# Altium schematic sheet 2020-08-15_10-10-351.schdoc
size 265 x 111 mm; SheetNumber: 1; SheetTotal: 1
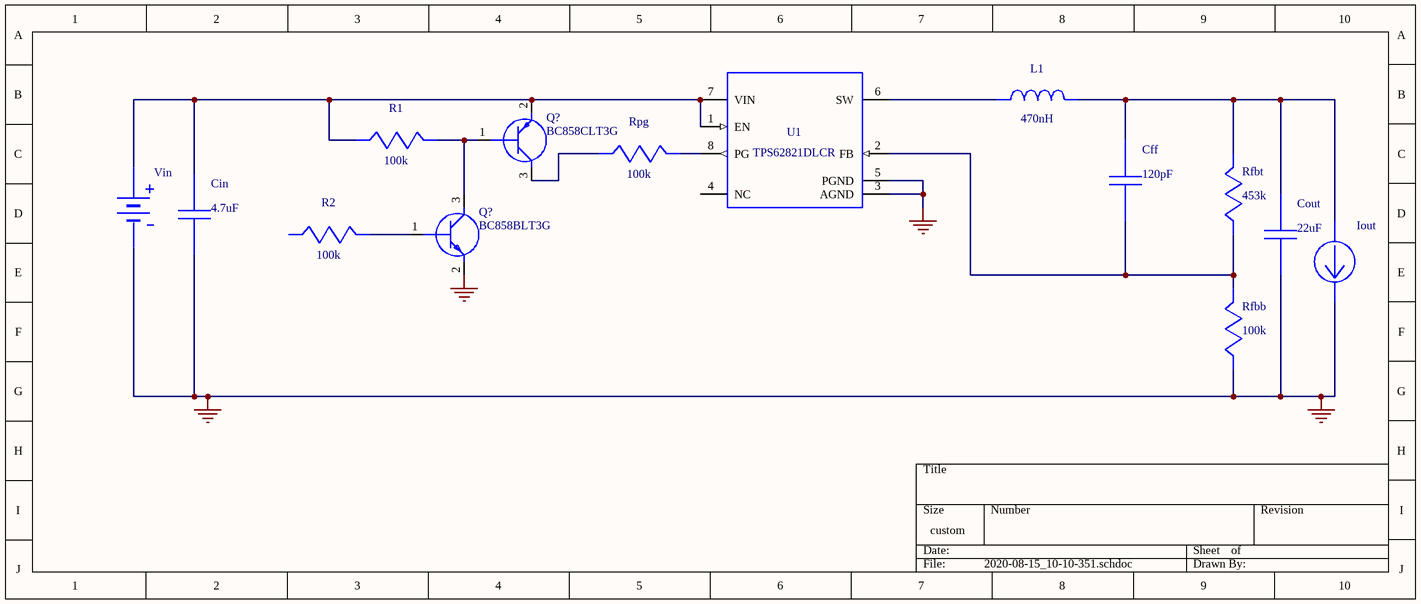
[diagram p0: 2020-08-15_10-10-351.schdoc]

## Parts
(Parts that share a designator on the sheet are numbered #1, #2 ... from top to bottom, then left to right.)
Cff  value 120pF  (hidden comment: GRM1555C1H121JA01D)
Cin  value 4.7uF  (hidden comment: C0603C475K9PACTU)
Cout  value 22uF  (hidden comment: C1608X5R1A226M080AC)
Iout  WB_CURRENT_LOAD  (value not drawn)
L1  value 470nH  (hidden comment: DFE201610E-R47M=P2)
Q?#1  BC858CLT3G  [BC858CLT3G]
Q?#2  BC858BLT3G  [SOT96P237X111-3N]
R1  value 100k  (hidden comment: RR1220P-104-D)
R2  value 100k  (hidden comment: RR1220P-104-D)
Rfbb  value 100k  (hidden comment: CRCW0402100KFKED)
Rfbt  value 453k  (hidden comment: CRCW0402453KFKED)
Rpg  value 100k  (hidden comment: RR1220P-104-D)
U1  TPS62821DLCR
Vin  WB_BATTERY  (value not drawn)

## Nets
0: Cin.2 Cout.2 Iout.2(-) Q?#2.2(E) Rfbb.2 U1.3(AGND) U1.5(PGND) Vin.2(-)
NetCff_1: Cff.1 Cout.1 Iout.1(+) L1.1 Rfbt.1
NetCff_2: Cff.2 Rfbb.1 Rfbt.2 U1.2(FB)
NetCin_1: Cin.1 Q?#1.2(E) R1.2 U1.1(EN) U1.7(VIN) Vin.1(+)
NetL1_2: L1.2 U1.6(SW)
NetQ?#1_1: Q?#1.1(B) Q?#2.3(C) R1.1
NetQ?#1_3: Q?#1.3(C) Rpg.2
NetQ?#2_1: Q?#2.1(B) R2.1
NetRpg_1: Rpg.1 U1.8(PG)

Not connected (* = marked no-connect by the designer): R2 2; U1 4(NC)

## Library data of the parts
Cff = GRM1555C1H121JA01D: GRM1555C1H121JA0; Manufacturer Name: MuRata; PackageReference: GRM1555C1H121JA01D; Manufacturer Part Number: GRM1555C1H121JA01D
Cin = C0603C475K9PACTU: Manufacturer Name: Kemet; PackageReference: C0603C475K9PACTU; Manufacturer Part Number: C0603C475K9PACTU
Cout = C1608X5R1A226M080AC: C1608X5R1A226M08; Manufacturer Name: TDK; PackageReference: C1608X5R1A226M080AC; Manufacturer Part Number: C1608X5R1A226M080AC
L1 = DFE201610E-R47M=P2: DFE201610E-R47M=; Manufacturer Name: MuRata; PackageReference: DFE201610E-R47M=P2; Manufacturer Part Number: DFE201610E-R47M=P2
Q?#1 = BC858CLT3G: Transistor BJT PNP; Manufacturer_Name: ON Semiconductor; Datasheet Link: https://componentsearchengine.com//BC858CLT3G.pdf; Mouser2 Part Number: 863-BC858CLT3G; Mouser2 Price/Stock: https://www.mouser.com/Search/Refine.aspx?Keyword=863-BC858CLT3G; Manufacturer_Part_Number: BC858CLT3G
Q?#2 = BC858BLT3G: Transistor BJT PNP; Manufacturer_Name: ON Semiconductor; Datasheet Link: https://www.onsemi.com/pub/Collateral/BC856ALT1-D.PDF; Height: 1.11mm; Manufacturer_Part_Number: BC858BLT3G
R1 R2 Rpg = RR1220P-104-D: Manufacturer Name: Susumu Co Ltd; PackageReference: RR1220P-104-D; Manufacturer Part Number: RR1220P-104-D
Rfbb = CRCW0402100KFKED: Manufacturer Name: Vishay-Dale; PackageReference: CRCW0402100KFKED; Manufacturer Part Number: CRCW0402100KFKED
Rfbt = CRCW0402453KFKED: Manufacturer Name: Vishay-Dale; PackageReference: CRCW0402453KFKED; Manufacturer Part Number: CRCW0402453KFKED
U1 = TPS62821DLCR: Manufacturer Name: Texas Instruments; PackageReference: TPS62821DLCR; Manufacturer Part Number: TPS62821DLCR; Value: N/A
Iout = WB_CURRENT_LOAD: PackageReference: WB_CURRENT_LOAD; Manufacturer Part Number: WB_CURRENT_LOAD; Manufacturer Name: WB_CURRENT_LOAD; Value: N/A
Vin = WB_BATTERY: PackageReference: WB_BATTERY; Manufacturer Part Number: WB_BATTERY; Manufacturer Name: WB_BATTERY; Value: N/A